# EAGLE design opt_H_Bridge (EAGLE 9.6.2)
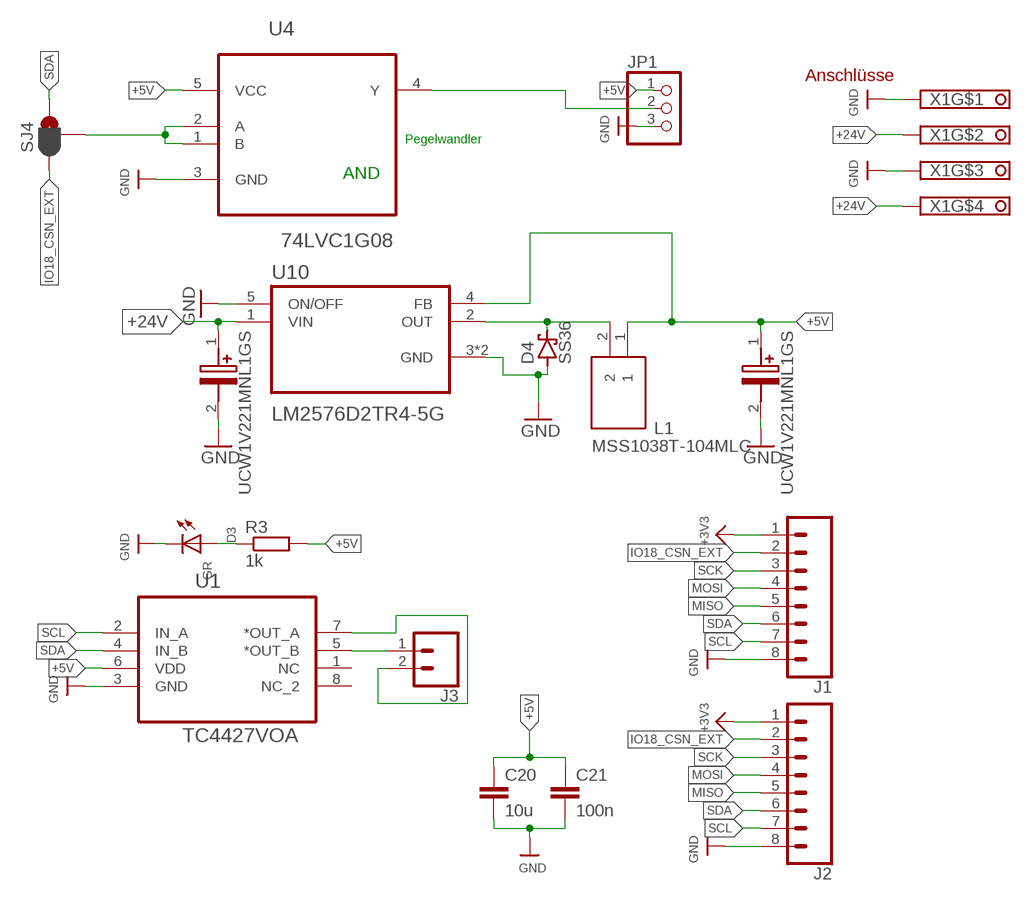
[diagram p0: schematic, sheet 1]

## Parts
C1  UCW1V221MNL1GS  [UWT(8X10)]
C20  10u  C-EUC0805  [C0805]
C21  100n  C-EUC0805  [C0805]
C31  UCW1V221MNL1GS  [UWT(8X10)]
D3  GR  LEDCHIP-LED0805  [CHIP-LED0805]
D4  SS36  SCHOTTKY-DIODESMC  [SMC]
J1  CONN_08BM08B-SRSS-TB  [BM08B-SRSS-TB]
J2  CONN_08BM08B-SRSS-TB  [BM08B-SRSS-TB]
J3  CONN_023.5MM  [SCREWTERMINAL-3.5MM-2]
JP1  PINHD-1X3  [1X03]
L1  MSS1038T-104MLC  MSS1038-473MLC  [INDPM102100X400N]
R3  1k  R-EU_R0805  [R0805]
SJ4  JUMPER_PAD-3-1&2_NC_BY_PASTE  [PAD-HUMPER-3-1&2_NC_BY_PASTE_YES_SILK_FULL_BOX]
U1  TC4427VOA  [SOIC127P600X175-8N]
U4  74LVC1G08  74LVC1G00GW  [SOT65P210X110-5N]
U10  LM2576D2TR4-5G  LM2576HVSX-ADJ/NOPB  [VREG_TPS79625KTTR]
X1  PT11304HBBN  TYP184  [TYP184_FT]

## Nets
+3V3 [power]: J1.1 J2.1
+5V [power]: C1.1(+) C20.1 C21.1 JP1.1 L1.1 R3.2 U1.6(VDD) U4.5(VCC) U10.4(FB)
+24V [power]: C31.1(+) U10.1(VIN) X1.2 X1.4
GND [power]: C1.2(-) C20.2 C21.2 C31.2(-) D3.C D4.A J1.8 J2.8 JP1.3 U1.3(GND) U4.3(GND) U10.3(GND) U10.5(ON/OFF) U10.6(GND) X1.1 X1.3
IO18_CSN_EXT: J1.2 J2.2 SJ4.1
MISO: J1.5 J2.5
MOSI: J1.4 J2.4
N$1: J3.1 U1.5(*OUT_B)
N$2: J3.2 U1.7(*OUT_A)
N$3: JP1.2 U4.4(Y)
N$4: SJ4.2 U4.1(B) U4.2(A)
N$5: D3.A R3.1
N$16: D4.C L1.2 U10.2(OUT)
SCK: J1.3 J2.3
SCL: J1.7 J2.7 U1.2(IN_A)
SDA: J1.6 J2.6 SJ4.3 U1.4(IN_B)
Unconnected: U1.1(NC) U1.8(NC_2)

## Notes on the sheet
- Anschlüsse
- Pegelwandler
- AND

## Library data of the parts
C1 C31 = UCW1V221MNL1GS:UCW1V221MNL1GS: Nichicon 220F +/-20% 35 V dc SMD Cylindrical Aluminium Electrolytic Capacitor Source: Datasheet <http://www.nichicon.co.jp/english/products/pdfs/e-ucw.pdf> Check prices <https://snapeda.com/parts/UCW1V221MNL1GS/Nichicon/view-part/?ref=eda>; ARROW_ELECTRONICS-PURCHASE-URL: https://snapeda.com/shop?store=Arrow+Electronics&id=522165; ARROW_EUROPE-PURCHASE-URL: https://snapeda.com/shop?store=Arrow+Europe&id=522165; AVAILABILITY: Good; DESCRIPTION: 220µF 35V Aluminum Electrolytic Capacitors Radial, Can - SMD 7000 Hrs @ 105°C; DIGIKEY-PURCHASE-URL: https://snapeda.com/shop?store=DigiKey&id=522165; MF: Nichicon; MOUSER-PURCHASE-URL: https://snapeda.com/shop?store=Mouser&id=522165; MP: UCW1V221MNL1GS; PACKAGE: Radial Nichicon; PRICE: None
C20 C21 = rcl:C-EU: CAPACITOR, European symbol; SPICEPREFIX: C
D3 = led:LED: LED OSRAM: - CHIPLED LG R971, LG N971, LY N971, LG Q971, LY Q971, LO R971, LY R971 LH N974, LH R974 LS Q976, LO Q976, LY Q976 LO Q996 - Hyper CHIPLED LW Q18S LB Q993, LB Q99A, LB R99A - SideLED LS A670, LO A670, LY A670, LG A670, LP A670 LB A673, LV A673, LT A673, LW A673 LH A674 LY A675 LS A676, LA A676, LO A676, LY A676, LW A676 LS A679, LY A679, LG A679 - Hyper Micro SIDELED® LS Y876, LA Y876, LO Y876, LY Y876 LT Y87S - SmartLED LW L88C, LW L88S LB L89C, LB L89S, LG L890 LS L89K, LO L89K, LY L89K LS L896, LA L896, LO L896, LY L896 - TOPLED LS T670, LO T670, LY T670, LG T670, LP T670 LSG T670, LSP T670, LSY T670, LOP T670, LYG T670 LG T671, LOG T671, LSG T671 LB T673, LV T673, LT T673, LW T673 LH T674 LS T676, LA T676, LO T676, LY T676, LB T676, LH T676, LSB T676, LW T676 LB T67C, LV T67C, LT T67C, LS T67K, LO T67K, LY T67K, LW E67C LS E67B, LA E67B, LO E67B, LY E67B, LB E67C, LV E67C, LT E67C LW T67C LS T679, LY T679, LG T679 LS T770, LO T770, LY T770, LG T770, LP T770 LB T773, LV T773, LT T773, LW T773 LH T774 LS E675, LA E675, LY E675, LS T675 LS T776, LA T776, LO T776, LY T776, LB T776 LHGB T686 LT T68C, LB T68C - Hyper Mini TOPLED® LB M676 - Mini TOPLED Santana® LG M470 LS M47K, LO M47K, LY M47K Source: http://www.osram.convergy.de LUXEON: - LUMILED® LXK2-PW12-R00, LXK2-PW12-S00, LXK2-PW14-U00, LXK2-PW14-V00 LXK2-PM12-R00, LXK2-PM12-S00, LXK2-PM14-U00 LXK2-PE12-Q00, LXK2-PE12-R00, LXK2-PE12-S00, LXK2-PE14-T00, LXK2-PE14-U00 LXK2-PB12-K00, LXK2-PB12-L00, LXK2-PB12-M00, LXK2-PB14-N00, LXK2-PB14-P00, LXK2-PB14-Q00 LXK2-PR12-L00, LXK2-PR12-M00, LXK2-PR14-Q00, LXK2-PR14-R00 LXK2-PD12-Q00, LXK2-PD12-R00, LXK2-PD12-S00 LXK2-PH12-R00, LXK2-PH12-S00 LXK2-PL12-P00, LXK2-PL12-Q00, LXK2-PL12-R00 Source: www.luxeon.com KINGBRIGHT: KA-3528ASYC Source: www.kingbright.com
D4 = diode:SCHOTTKY-DIODE: Schottky Diode
J1 J2 = SparkFun-Connectors:CONN_08: Multi connection point. Often used as Generic Header-pin footprint for 0.1 inch spaced/style header connections On any of the 0.1 inch spaced packages, you can populate with these: Break Away Headers - Straight <https://www.sparkfun.com/products/116> (PRT-00116) Break Away Male Headers - Right Angle <https://www.sparkfun.com/products/553> (PRT-00553) Female Headers <https://www.sparkfun.com/products/115> (PRT-00115) Break Away Headers - Machine Pin <https://www.sparkfun.com/products/117> (PRT-00117) Break Away Female Headers - Swiss Machine Pin <https://www.sparkfun.com/products/743> (PRT-00743) Arduino Stackable Header - 8 Pin <https://www.sparkfun.com/products/9279> (PRT-09279) For SCREWTERMINALS and SPRING TERMINALS visit here: Screw Terimnals on SparkFun.com <https://www.sparkfun.com/search/results?term=Screw+Terminals> (5mm/3.5mm/2.54mm spacing) This device is also useful as a general connection point to wire up your design to another part of your project. Our various solder wires solder well into these plated through hole pads. Hook-Up Wire - Assortment (Stranded, 22 AWG) <https://www.sparkfun.com/products/11375> (PRT-11375) Hook-Up Wire - Assortment (Solid Core, 22 AWG) <https://www.sparkfun.com/products/11367> (PRT-11367) View the entire wire category on our website here <https://www.sparkfun.com/categories/141> Special notes: Molex polarized connector foot print use with SKU : PRT-08231 with associated crimp pins and housings. 1MM SMD Version SKU: PRT-10208 NOTES ON THE VARIANTS LOCK and LOCK_LONGPADS... This footprint was designed to help hold the alignment of a through-hole component (i.e. 6-pin header) while soldering it into place. You may notice that each hole has been shifted either up or down by 0.005 of an inch from it's more standard position (which is a perfectly straight line). This slight alteration caused the pins (the squares in the middle) to touch the edges of the holes. Because they are alternating, it causes a "brace" to hold the component in place. 0.005 has proven to be the perfect amount of "off-center" position when using our standard breakaway headers. Although looks a little odd when you look at the bare footprint, once you have a header in there, the alteration is very hard to notice. Also,if you push a header all the way into place, it is covered up entirely on the bottom side.; PROD_ID: CONN-10556
J3 = SparkFun-Connectors:CONN_02: Multi connection point. Often used as Generic Header-pin footprint for 0.1 inch spaced/style header connections On any of the 0.1 inch spaced packages, you can populate with these: Break Away Headers - Straight <https://www.sparkfun.com/products/116> (PRT-00116) Break Away Male Headers - Right Angle <https://www.sparkfun.com/products/553> (PRT-00553) Female Headers <https://www.sparkfun.com/products/115> (PRT-00115) Break Away Headers - Machine Pin <https://www.sparkfun.com/products/117> (PRT-00117) Break Away Female Headers - Swiss Machine Pin <https://www.sparkfun.com/products/743> (PRT-00743) For SCREWTERMINALS and SPRING TERMINALS visit here: Screw Terimnals on SparkFun.com <https://www.sparkfun.com/search/results?term=Screw+Terminals> (5mm/3.5mm/2.54mm spacing) This device is also useful as a general connection point to wire up your design to another part of your project. Our various solder wires solder well into these plated through hole pads. Hook-Up Wire - Assortment (Stranded, 22 AWG) <https://www.sparkfun.com/products/11375> (PRT-11375) Hook-Up Wire - Assortment (Solid Core, 22 AWG) <https://www.sparkfun.com/products/11367> (PRT-11367) View the entire wire category on our website here <https://www.sparkfun.com/categories/141> Special notes: Molex polarized connector foot print use with: PRT-08233 with associated crimp pins and housings. 2.54_SCREWTERM for use with PRT-10571. 3.5mm Screw Terminal footprints for PRT-08084 5mm Screw Terminal footprints for use with PRT-08432; PROD_ID: CONN-08399
JP1 = pinhead:PINHD-1X3: PIN HEADER
L1 = MSS1038-473MLC:MSS1038-473MLC: Fixed Inductors MSS1038 SMT Shielded 47 uH 20 % 2.2 A Source: Datasheet <https://componentsearchengine.com/Datasheets/1/MSS1038-473MLC.pdf>; DESCRIPTION: Fixed Inductors MSS1038 SMT Shielded 47 uH 20 % 2.2 A; HEIGHT: 4mm; MANUFACTURER_NAME: COILCRAFT; MANUFACTURER_PART_NUMBER: MSS1038-473MLC; MOUSER_PART_NUMBER: 994-MSS1038-473MLC; MOUSER_PRICE-STOCK: https://www.mouser.com/Search/Refine.aspx?Keyword=994-MSS1038-473MLC
R3 = rcl:R-EU_: RESISTOR, European symbol; SPICEPREFIX: R
SJ4 = SparkFun-Passives:JUMPER_PAD-3-1&2_NC_BY_PASTE
U1 = TC4427VOA:TC4427VOA: IC, MOSFET DRIVER, LOW SIDE Check prices <https://pricing.snapeda.com/parts/TC4427VOA/Microchip/view-part?ref=eda>; AVAILABILITY: Warning; DESCRIPTION: Low-Side Gate Driver IC Non-Inverting 8-SOIC; MF: Microchip; MP: TC4427VOA; PACKAGE: SO-8 Microchip; PRICE: None; PURCHASE-URL: https://pricing.snapeda.com/search/part/TC4427VOA/?ref=eda
U4 = 74LVC1G00GW:74LVC1G00GW: Single 2-input NAND gate; AVAILABILITY: Unavailable; DESCRIPTION: NAND Gate 1-Element 2-IN CMOS 5-Pin TSSOP T/R; MF: Nexperia; MP: 74LVC1G00GW; PACKAGE: None; PRICE: None
U10 = LM2576HVSX-ADJ_NOPB:LM2576HVSX-ADJ/NOPB: Check prices <https://snapeda.com/parts/LM2576HVSX-ADJ/NOPB/Texas%20Instruments/view-part/?ref=eda>; AVAILABILITY: Good; DESCRIPTION: SIMPLE SWITCHER&reg; 4V to 60V, 3A Low Component Count Step-Down Regulator 5-DDPAK/TO-263 -40 to 125; DIGIKEY-PURCHASE-URL: https://snapeda.com/shop?store=DigiKey&id=493055; MF: Texas Instruments; MOUSER-PURCHASE-URL: https://snapeda.com/shop?store=Mouser&id=493055; MP: LM2576HVSX-ADJ/NOPB; PACKAGE: TO-263-5 Texas Instruments; PRICE: None; TEXAS_INSTRUMENTS-PURCHASE-URL: https://snapeda.com/shop?store=Texas+Instruments&id=493055
X1 = MetzConnect182_183:TYP184

## Net classes
0 default: width 0.127 mm
1 power: width 0.508 mm

## Board
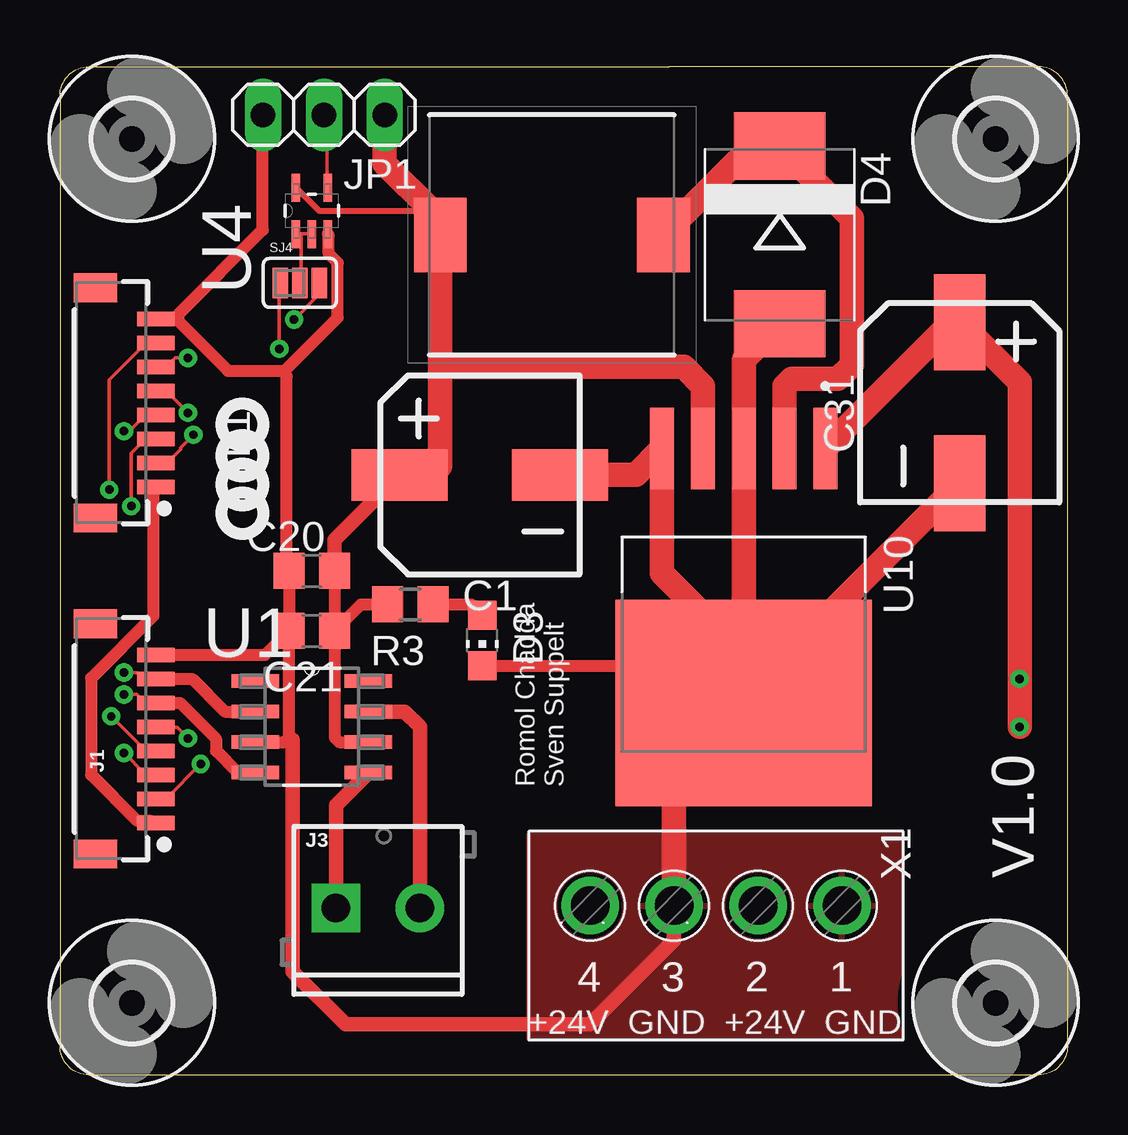
[diagram p1: board, top side]
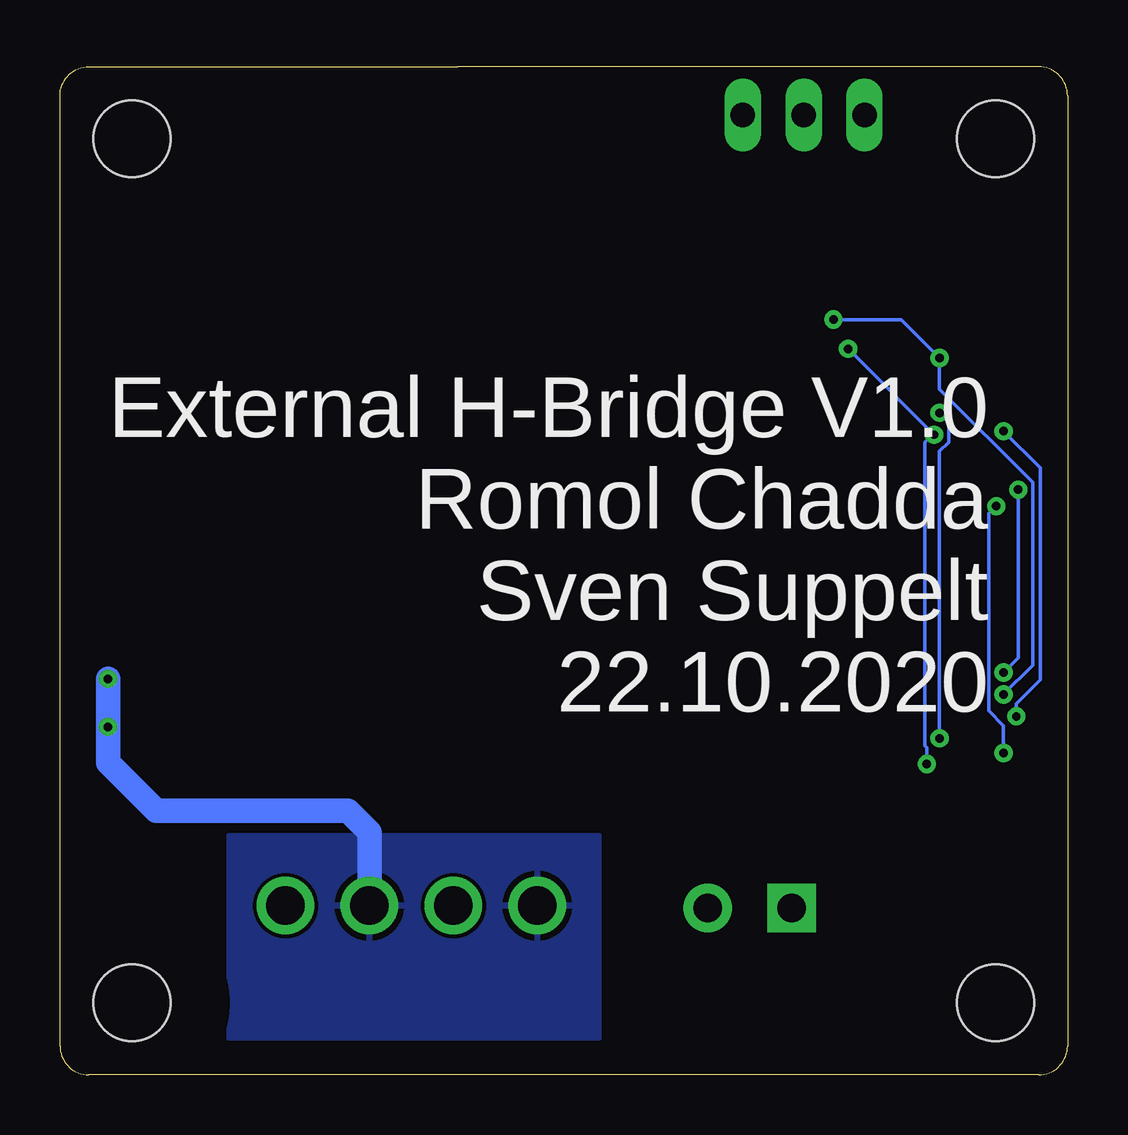
[diagram p2: board, bottom side, seen from below]

Size 42 x 42 mm. Coordinates in mm from the lower left corner, seen from the top.
Outline: 6,42 1.2,42 arc90 0,40.8 0,1.2 arc90 1.2,0 40.8,0 arc90 42,1.2 42,40.8 arc90 40.8,42 25.4,42 6,42
Outline: 6,42 6.6,42
Copper layers (1*16): Top 0.035mm / dielectric 1.5mm / Bottom 0.035mm
Design rules "default *": minimum track width 6mil, minimum drill 0.35mm, track to track 6mil, track to pad 6mil, pad to pad 6mil, via to via 6mil, smd to smd 6mil, copper to edge 40mil, drill to drill 6mil, minimum pad ring 10mil, minimum via ring 8mil, stop-mask expansion 4mil, vias tented up to drill 0.4mm, thermal gap 10mil

### Footprints (pad centres in the part's own frame; a part is rotated, then mirrored left to right if it is on the bottom)
UWT(8X10) = smd 4 x 2.15: 1 -3.35,0; 2 3.35,0
C0805 = smd 1.3 x 1.5: 1 -0.95,0; 2 0.95,0
CHIP-LED0805 = smd 1.2 x 1.2: A 0,-1.05; C 0,1.05
SMC = smd 2.8 x 3.8: A 3.7,0; C -3.7,0
BM08B-SRSS-TB = smd 0.6 x 1.55: 1 -3.5,0; 2 -2.5,0; 3 -1.5,0; 4 -0.5,0; 5 0.5,0; 6 1.5,0; 7 2.5,0; 8 3.5,0 | smd 1.2 x 1.8: P$9 4.8,2.525; P$10 -4.8,2.525
SCREWTERMINAL-3.5MM-2 = drill 1.2 pad 2.032 square: 1 0,0 | drill 1.2 pad 2.032: 2 3.5,0
1X03 = drill 1.016 long: 1 -2.54,0; 2 0,0; 3 2.54,0
INDPM102100X400N = smd 2.2 x 3.1: 1 -4.65,0; 2 4.65,0
R0805 = smd 1.3 x 1.5: 1 -0.95,0; 2 0.95,0
PAD-HUMPER-3-1&2_NC_BY_PASTE_YES_SILK_FULL_BOX = smd 0.635 x 1.27: 1 -0.813,0; 2 0,0; 3 0.813,0
SOIC127P600X175-8N = smd 1.981 x 0.559: 1 -2.362,1.905; 2 -2.362,0.635; 3 -2.362,-0.635; 4 -2.362,-1.905; 5 2.362,-1.905; 6 2.362,-0.635; 7 2.362,0.635; 8 2.362,1.905
SOT65P210X110-5N = smd 1.168 x 0.356: 1 -0.965,0.66; 2 -0.965,0; 3 -0.965,-0.66; 4 0.965,-0.66; 5 0.965,0.66
VREG_TPS79625KTTR = smd 3.4 x 1: 1 -10.6,3.4; 2 -10.6,1.7; 3 -10.6,0; 4 -10.6,-1.7; 5 -10.6,-3.4 | smd 8.6 x 10.7: 6 0,0
3,2 = hole 3.2: 0,0
TYP184_FT = drill 1.6 pad 2.2: 1 -5.25,-0.1; 2 -1.75,-0.1; 3 1.75,-0.1; 4 5.25,-0.1

### Placement (x,y rotation side)
C1  17.5,25 0 top
C20  10.5,21 180 top
C21  10.5,18.5 180 top
C31  37.5,28 270 top
D3  17.6,18.1 180 top
D4  30,35 270 top
J1  4,14 90 top
J2  4,28 90 top
J3  11.5,6.95 0 top
JP1  11,40 180 top
L1  20.5,35 0 top
R3  14.6,19.6 180 top
SJ4  10,33 0 top
U1  10.5,14.5 0 top
U4  10.5,36 90 top
U10  28.5,15.5 270 top
U$1  [3,2]  3,39 0 top
U$2  [3,2]  39,39 0 top
U$3  [3,2]  3,3 0 top
U$4  [3,2]  39,3 0 top
X1  27.35,6.95 180 top

### Tracks (layer width: path | path; a pad name or v marks a point on that pad's centre or on a via)
+3V3
  Top 0.508: 3.96,10.52 J1.1 3.73,10.59 3.2,10.59 1.29,12.5 1.29,16.54 3.89,19.13 3.89,24.23 J2.1 3.96,24.46
+5V
  Top 0.254: U4.5 10.8,36 15.5,36
  Top 0.508: C21.1 11.45,14.05 11.63,13.87 U1.6 | C20.1 C21.1 | C21.1 12.55,19.6 R3.2
  Top 0.61: C20.1 11.45,22.3 C1.1
  Top 1.016: 15.85,29.5 L1.1 15.85,35.65 15.5,36 13.54,37.96 JP1.1 | 15.85,29.5 15.85,25.35 15,24.5 14.65,24.5 C1.1 | U10.4 26.8,28.7 26,29.5 15.85,29.5
+24V  (via drill 0.35)
  Top 1.016: v40,14.5 v40,16.5 40,28.85 C31.1 37.15,31.35 U10.1
  Bottom 1.016: X1.2 29.1,10.1 30,11 38,11 40,13 v40,14.5 v40,16.5
  pour Bottom: 19.5,10 35,10 35,1.5 19.5,1.5
GND
  Top 0.508: U1.3 9.37,13.87 9.46,13.96 | 9.46,13.96 9.7,13.96 | C21.2 9.55,14.05 9.46,13.96 | C21.2 C20.2 9.45,21.18 9.45,29.11 9.37,29.34 | J1.8 8.55,17.5 C21.2 | 9.37,29.34 11.58,31.55 11.58,33.83 11.2,34.21 11.2,34.98 U4.3 | 9.37,29.34 7.01,29.34 4.88,31.47 | 4.88,31.47 4.04,31.47 J2.8 | JP1.3 8.46,39.93 8.46,35.2 4.95,31.7 4.88,31.47 | D3.C 26.15,17.05 28.1,15.1
  Top 0.61: 9.7,13.96 9.7,4.3 11.9,2.1 22.1,2.1 25.6,5.6 X1.3
  Top 1.016: C31.2 28.5,15.65 U10.6 | U10.6 28.1,15.1 25.6,12.6 X1.3 | C1.2 24,25 U10.5 25.1,20.9 28.5,17.5 U10.6 | D4.A 28.5,29.8 U10.3 U10.6 | U10.6 28.25,15.25
  pour Top: 19.5,10 35,10 35,1.5 19.5,1.5
IO18_CSN_EXT  (via drill 0.35)
  Top 0.152: v9.14,30.25 9.14,32.99 SJ4.1 | v5.56,26.67 5.03,26.14 5.03,26.06 4.5,25.53 4.04,25.53 J2.2 | v5.87,12.95 4.42,11.51 4.04,11.51 J1.2
  Bottom 0.152: v9.14,30.25 v5.56,26.67 5.64,26.67 5.94,26.36 5.94,13.72 5.87,13.64 v5.87,12.95
MISO  (via drill 0.35)
  Top 0.152: 3.5,14.55 3.96,14.55 J1.5 4.04,14.48 4.88,14.48 v5.33,14.02 | 4.42,28.5 4.04,28.5 J2.5 4.42,28.5 | 4.42,28.5 v5.33,27.58
  Bottom 0.152: v5.33,14.02 5.33,25.98 4.95,26.36 4.95,27.2 v5.33,27.58
MOSI  (via drill 0.35)
  Top 0.152: 4.5,27.43 4.04,27.43 J2.4 3.96,27.43 3.5,27.43 2.9,26.82 v2.67,26.82 | 4.04,13.56 J1.4 3.96,13.56 3.5,13.56 v2.13,14.94
  Bottom 0.152: v2.13,14.94 2.13,15.47 1.14,16.46 1.14,25.3 v2.67,26.82
N$1
  Top 0.61: U1.5 11.5,11.23 J3.1
N$2
  Top 0.61: U1.7 14.37,15.13 15,14.5 J3.2
N$3
  Top 0.152: U4.4 11.12,37.03 11.12,39.85 11.05,39.93 JP1.2
N$4
  Top 0.152: 10.06,35.05 10.44,35.05 U4.2 | 10.06,35.05 9.91,35.05 U4.1 | 10.06,33.07 SJ4.2 10.06,33.15 10.06,35.05
N$5
  Top 0.508: R3.1 17.15,19.6 D3.A
N$16
  Top 1.016: L1.2 28.85,38.7 D4.C 33,35.7 33,29.57 32.43,29 30.5,29 30.2,28.7 U10.2
SCK  (via drill 0.35)
  Top 0.152: 3.5,12.57 3.96,12.57 J1.3 3.5,12.57 | 3.5,26.44 3.96,26.44 J2.3 3.5,26.44 | v2.67,13.41 3.5,12.57 | v2.97,23.7 2.97,25.91 3.5,26.44
  Bottom 0.152: v2.67,13.41 2.67,14.55 3.28,15.16 3.28,23.39 v2.97,23.7
SCL  (via drill 0.35)
  Top 0.152: 3.58,30.48 3.96,30.48 J2.7 3.58,30.48 | 3.35,16.61 3.81,16.61 J1.7 3.35,16.61 | 3.58,30.48 2.06,28.96 v2.06,24.38 | v2.67,16.76 3.2,16.76 3.35,16.61
  Top 0.508: J1.7 5.5,16.5 6.87,15.13 U1.2
  Bottom 0.152: v2.06,24.38 2.06,17.37 v2.67,16.76
SDA  (via drill 0.35)
  Top 0.152: 10.74,32.46 10.74,32.99 SJ4.3 10.74,32.46 | 4.5,29.57 4.04,29.57 J2.6 4.5,29.57 | 3.43,15.62 3.81,15.62 J1.6 3.43,15.62 | v9.75,31.47 10.74,32.46 | v5.33,29.87 4.8,29.87 4.5,29.57 | v2.67,15.85 3.2,15.85 3.43,15.62
  Top 0.508: J1.6 5,15.5 6.5,14 6.5,13.5 7.41,12.6 U1.4
  Bottom 0.152: v9.75,31.47 6.93,31.47 v5.33,29.87 5.33,28.57 1.45,24.69 1.45,17.07 v2.67,15.85

### Text on the board
tPlace: Romol Chadda / Sven Suppelt | V1.0
bPlace: External H-Bridge V1.0 / Romol Chadda / Sven Suppelt / 22.10.2020
tNames: +24V GND +24V GND